# Altium schematic sheet #NIP涡轮驱动板-Sense.SchDoc
size A3
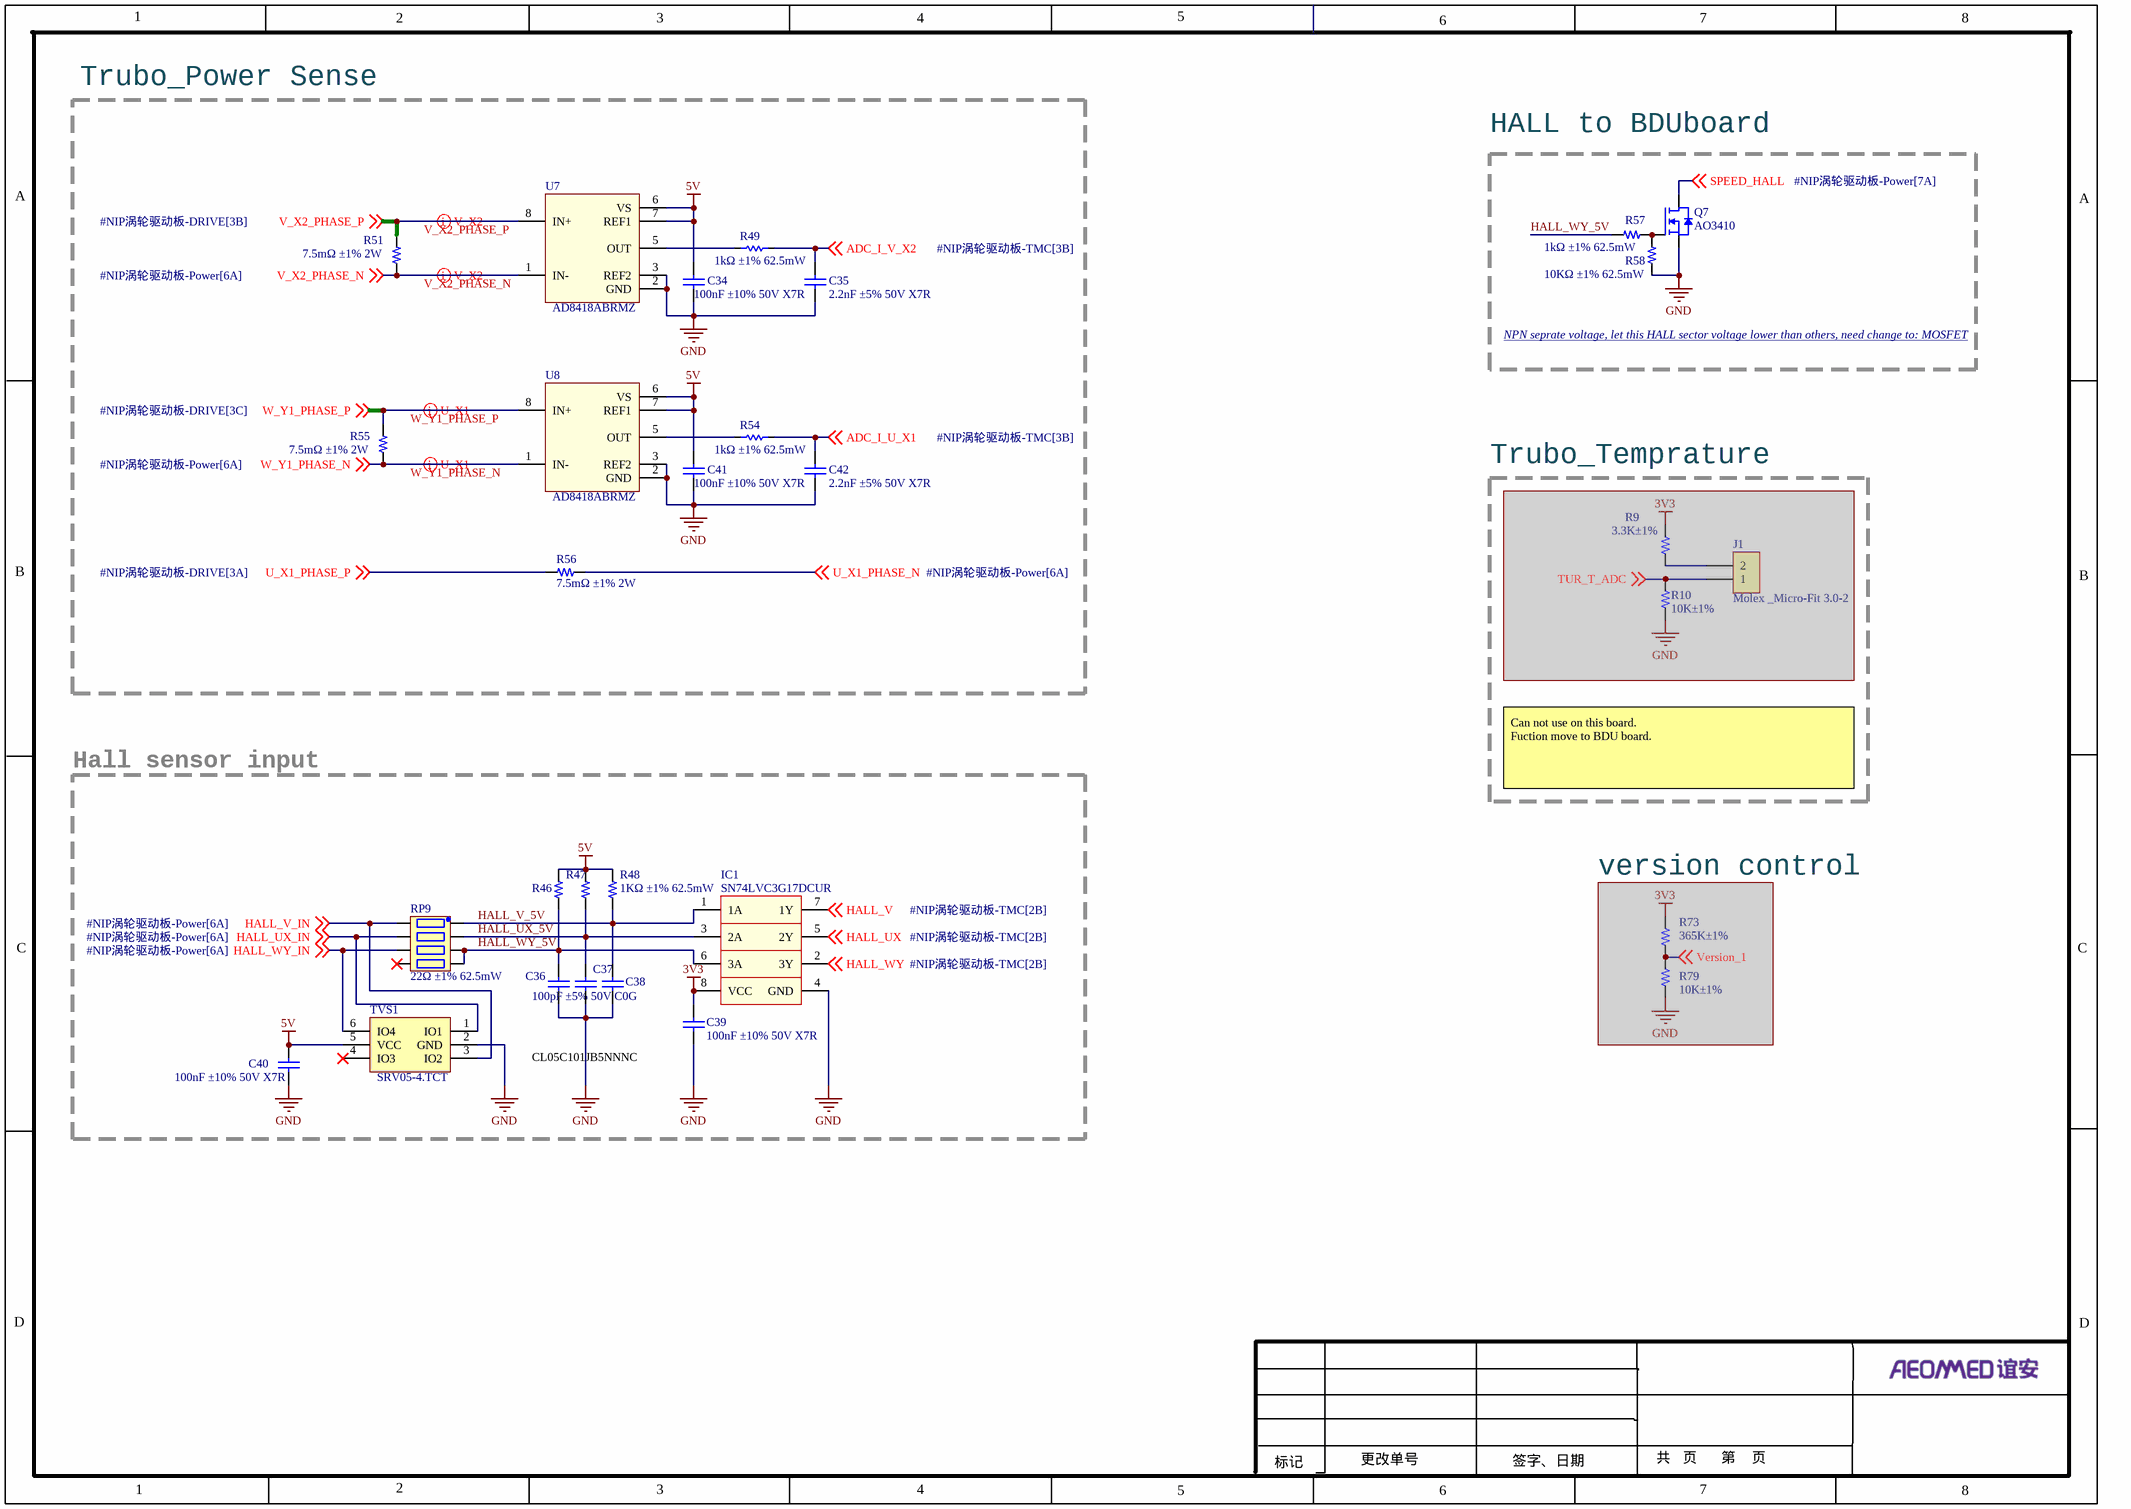
[diagram p0: #NIP涡轮驱动板-Sense.SchDoc]

## Parts
C34  100nF ±10% 50V X7R  [C0402]
C35  2.2nF ±5% 50V X7R  [C0402]
C36  100pF ±5% 50V C0G  [C0402]
C37  100pF ±5% 50V C0G  [C0402]  (value not drawn)
C38  100pF ±5% 50V C0G  [C0402]  (value not drawn)
C39  100nF ±10% 50V X7R  [C0402]
C40  100nF ±10% 50V X7R  [C0402]
C41  100nF ±10% 50V X7R  [C0402]
C42  2.2nF ±5% 50V X7R  [C0402]
IC1  SN74LVC3G17DCUR  [TSSOP50P310X90-8L]
J1  Molex _Micro-Fit 3.0-2  [Molex _Micro-Fit 3.0 2X1]  (masked out: inside a compile mask, not in the netlist)
Q7  AO3410  [SOT23-3]
R9  3.3K±1%  [R-0603]  (masked out: inside a compile mask, not in the netlist)
R10  10K±1%  [R-0603]  (masked out: inside a compile mask, not in the netlist)
R46  1KΩ ±1% 62.5mW  [R0402]  (value not drawn)
R47  1KΩ ±1% 62.5mW  [R0402]  (value not drawn)
R48  1KΩ ±1% 62.5mW  [R0402]
R49  1kΩ ±1% 62.5mW  [R0402]
R51  7.5mΩ ±1% 2W  [R-2512_4PIN]
R54  1kΩ ±1% 62.5mW  [R0402]
R55  7.5mΩ ±1% 2W  [R-2512_4PIN]
R56  7.5mΩ ±1% 2W  [R-2512_4PIN]
R57  1kΩ ±1% 62.5mW  [R0402]
R58  10KΩ ±1% 62.5mW  [R0402]
R73  365K±1%  [R-0603]  (masked out: inside a compile mask, not in the netlist)
R79  10K±1%  [R-0603]  (masked out: inside a compile mask, not in the netlist)
RP9  22Ω ±1% 62.5mW  [RES-ARRAY-SMD_0402-8P-L2.0-W1.0-BL]
TVS1  SRV05-4.TCT  [SOT95P280X145-6N]
U7  AD8418ABRMZ  [TSOP65P490X95-8N]
U8  AD8418ABRMZ  [TSOP65P490X95-8N]

## Blocks framed on the sheet
Trubo_Power Sense: C34 C35 C41 C42 R49 R51 R54-R56 U7 U8
HALL to BDUboard: Q7 R57 R58
Trubo_Temprature: J1 R9 R10
Hall sensor input: C36-C40 IC1 R46-R48 RP9 TVS1

## Nets
3V3: C39.2 IC1.8(VCC)
5V: C34.1 C40.1 C41.1 R46.2 R47.2 R48.2 TVS1.5(VCC) U7.6(VS) U7.7(REF1) U8.6(VS) U8.7(REF1)
GND: C34.2 C35.2 C36.1 C37.1 C38.1 C39.1 C40.2 C41.2 C42.2 IC1.4(GND) Q7.2(S) R58.2 TVS1.2(GND) U7.2(GND) U7.3(REF2) U8.2(GND) U8.3(REF2)
ADC_I_U_X1: C42.1 R54.2 ; off-sheet ADC_I_U_X1
ADC_I_V_X2: C35.1 R49.2 ; off-sheet ADC_I_V_X2
HALL_UX: IC1.5(2Y) ; off-sheet HALL_UX
HALL_UX_5V: C37.2 IC1.3(2A) R47.1 RP9.2
HALL_UX_IN: RP9.7 TVS1.1(IO1) ; off-sheet HALL_UX_IN
HALL_V: IC1.7(1Y) ; off-sheet HALL_V
HALL_V_5V: C38.2 IC1.1(1A) R48.1 RP9.1
HALL_V_IN: RP9.8 TVS1.3(IO2) ; off-sheet HALL_V_IN
HALL_WY: IC1.2(3Y) ; off-sheet HALL_WY
HALL_WY_5V: C36.2 IC1.6(3A) R46.1 R57.2 RP9.3 RP9.4
HALL_WY_IN: RP9.6 TVS1.6(IO4) ; off-sheet HALL_WY_IN
SPEED_HALL: Q7.3(D) ; off-sheet SPEED_HALL
U_X1_PHASE_N: R56.1 ; off-sheet U_X1_PHASE_N
U_X1_PHASE_P: R56.2 ; off-sheet U_X1_PHASE_P
V_X2_PHASE_N: R51.1 U7.1(IN-) ; off-sheet V_X2_PHASE_N
V_X2_PHASE_P: R51.2 U7.8(IN+) ; off-sheet V_X2_PHASE_P
W_Y1_PHASE_N: R55.1 U8.1(IN-) ; off-sheet W_Y1_PHASE_N
W_Y1_PHASE_P: R55.2 U8.8(IN+) ; off-sheet W_Y1_PHASE_P
NetQ7_1: Q7.1(G) R57.1 R58.1
NetR49_1: R49.1 U7.5(OUT)
NetR54_1: R54.1 U8.5(OUT)

Not connected (* = marked no-connect by the designer): RP9 5*; TVS1 4(IO3)*

## Layout directives
differential pair: V_X2_PHASE_N, V_X2_PHASE_P, W_Y1_PHASE_N, W_Y1_PHASE_P

## Notes on the sheet
- NPN seprate voltage, let this HALL sector voltage lower than others, need change to: MOSFET
- Can not use on this board.
  Fuction move to BDU board.
- (near R73) version control
- CL05C101JB5NNNC
- 1
- 2
- 3
- 4
- 5
- 6
- 7
- 8
- A
- B
- C
- D
- 更改单号
- 共   页      第    页
- 标记
- 签字、日期

## Library data of the parts
C34 C39-C41 = Cap: Capacitor; Published: 8-Jun-2000; LatestRevisionDate: 17-Jul-2002; LatestRevisionNote: Re-released for DXP Platform.; PackageReference: RAD-0.3; Publisher: Altium Limited; PackageDescription: Radial Cap, Thru-Hole; 2 Leads; 0.3 in Pin Spacing
C35 C42 = Cap: CL05B222JB5NNNC; Published: 8-Jun-2000; LatestRevisionDate: 17-Jul-2002; LatestRevisionNote: Re-released for DXP Platform.; PackageReference: RAD-0.3; Publisher: Altium Limited; PackageDescription: Radial Cap, Thru-Hole; 2 Leads; 0.3 in Pin Spacing
C36-C38 = Cap: CL05C101JB5NNNC; Published: 8-Jun-2000; LatestRevisionDate: 17-Jul-2002; LatestRevisionNote: Re-released for DXP Platform.; PackageReference: RAD-0.3; Publisher: Altium Limited; PackageDescription: Radial Cap, Thru-Hole; 2 Leads; 0.3 in Pin Spacing
IC1 = SN74LVC3G17DCUR: 品牌：TI，型号： 74LVC3G17, 1.65 V to 5.5 V, VSSOP-8，，ROH; MF: TEXAS INSTRUMENTS; MPN: SN74LVC3G17DCUR
J1 = Molex _Micro-Fit 3.0-2: 品牌：Molex,型号：43045-0227，直插，间距3.00，2pin，表面镀锡，ROHS; 名称: 接插件; 物料编号: 43045-0227; 详细描述: 品牌：Molex,型号：43045-0227，直插，间距3.00，2pin，表面镀锡，ROHS; 制造商: Molex
R9 R10 R46-R48 R57 R58 R73 R79 = R-0603
R49 R54 = Res_0402: Resistor; Published: 8-Jun-2000; LatestRevisionDate: 17-Jul-2002; LatestRevisionNote: Re-released for DXP Platform.; PackageReference: AXIAL-0.3; Publisher: Altium Limited; PackageDescription: Axial Device, Thru-Hole; 2 Leads; 0.3 in Pin Spacing
R51 R55 R56 = R-2512: PA2512FKF7W7U5E / 7.5mOhms 2W 100PPM/C 1 % 2512
RP9 = RP-0603
TVS1 = ESD, TVS, SRV05-4.TCT: 品牌：SEMTECH ，型号：SRV05-4.TCT，ROHS; MPN: SRV05-4.TCT; MF: SEMTECH
U7 U8 = AD8418: 品牌：ADI，型号：AD8418ABRMZ，ROHS; Manufacturer: Analog Devices; Id: 50496; Value: CMVR=70V; Part Number: AD8418ABRMZ; Type: DIFAMP; HelpURL: http://www.analog.com/media/en/technical-documentation/data-sheets/AD8418A.pdf